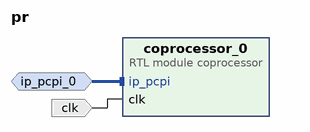
[diagram p0: block diagram of the top level]
# Vivado block design pr, xc7z020clg400-1, Vivado 2018.2
create_bd_design pr

create_bd_intf_port -mode Slave -vlnv cliffordwolf:ip:pcpi_rtl:1.0 ip_pcpi_0
create_bd_port -dir I -type clk clk
set_property -dict {CONFIG.FREQ_HZ 100000000} [get_bd_ports clk]

create_bd_cell -type module -reference coprocessor coprocessor_0

# ---- connections ----

connect_bd_intf_net -intf_net ip_pcpi_0_1 [get_bd_intf_ports ip_pcpi_0] [get_bd_intf_pins coprocessor_0/ip_pcpi]
connect_bd_net [get_bd_ports clk] [get_bd_pins coprocessor_0/clk]

validate_bd_design
save_bd_design
